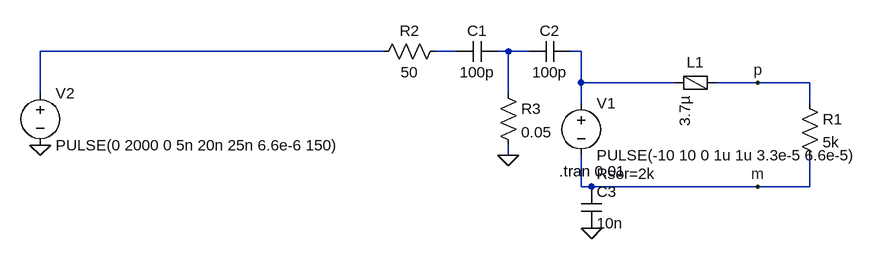
[diagram p0: schematic EingangMItFerriteBead.asc]
EingangMItFerriteBead.asc, the LTspice schematic file:
Version 4
SHEET 1 880 680
WIRE -208 64 -736 64
WIRE -96 64 -128 64
WIRE -16 64 -32 64
WIRE 16 64 -16 64
WIRE 96 64 80 64
WIRE 96 112 96 64
WIRE 240 112 96 112
WIRE 368 112 304 112
WIRE 448 112 368 112
WIRE -736 128 -736 64
WIRE -16 128 -16 64
WIRE 96 144 96 112
WIRE 448 144 448 112
WIRE -16 224 -16 208
WIRE 96 272 96 224
WIRE 112 272 96 272
WIRE 368 272 112 272
WIRE 448 272 448 224
WIRE 448 272 368 272
FLAG -736 208 0
FLAG -16 224 0
FLAG 112 336 0
FLAG 368 112 p
FLAG 368 272 m
SYMBOL voltage 96 128 R0
WINDOW 123 0 0 Left 2
WINDOW 39 24 124 Left 2
SYMATTR InstName V1
SYMATTR Value PULSE(-10 10 0 1u 1u 3.3e-5 6.6e-5)
SYMATTR SpiceLine Rser=2k
SYMBOL FerriteBead 272 112 R90
WINDOW 0 -16 0 VBottom 2
SYMATTR InstName L1
SYMATTR Value 3.7µ
SYMATTR SpiceLine Ipk=1 Rser=0.179 Rpar=1100 Cpar=1.15p mfg="Würth Elektronik" pn="782763102 WE-CBA 1206"
SYMBOL res 432 128 R0
SYMATTR InstName R1
SYMATTR Value 5k
SYMBOL voltage -736 112 R0
WINDOW 123 0 0 Left 2
WINDOW 39 0 0 Left 2
SYMATTR InstName V2
SYMATTR Value PULSE(0 2000 0 5n 20n 25n 6.6e-6 150)
SYMBOL res -112 48 R90
WINDOW 0 0 56 VBottom 2
WINDOW 3 32 56 VTop 2
SYMATTR InstName R2
SYMATTR Value 50
SYMBOL cap -32 48 R90
WINDOW 0 0 32 VBottom 2
WINDOW 3 32 32 VTop 2
SYMATTR InstName C1
SYMATTR Value 100p
SYMBOL cap 80 48 R90
WINDOW 0 0 32 VBottom 2
WINDOW 3 32 32 VTop 2
SYMATTR InstName C2
SYMATTR Value 100p
SYMBOL res -32 112 R0
SYMATTR InstName R3
SYMATTR Value 0.05
SYMBOL cap 96 272 R0
SYMATTR InstName C3
SYMATTR Value 10n
TEXT 62 248 Left 2 !.tran 0.01

The netlist it stands for:
* EingangMItFerriteBead.asc
V1 N004 m PULSE(-10 10 0 1u 1u 3.3e-5 6.6e-5) Rser=2k
L1 p N004 3.7µ Ipk=1 Rser=0.179 Rpar=1100 Cpar=1.15p mfg="Würth Elektronik" pn="782763102 WE-CBA 1206"
R1 p m 5k
V2 N001 0 PULSE(0 2000 0 5n 20n 25n 6.6e-6 150)
R2 N002 N001 50
C1 N003 N002 100p
C2 N004 N003 100p
R3 N003 0 0.05
C3 m 0 10n
.tran 0.01
.backanno
.end